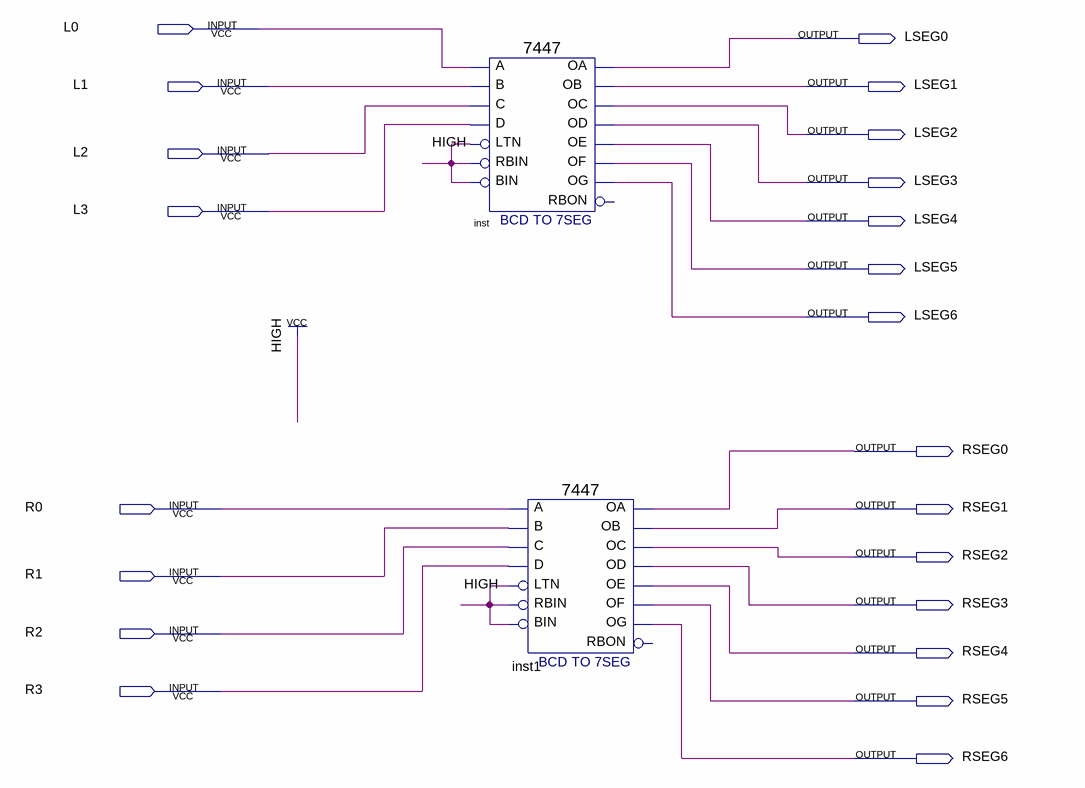
[diagram p0: schematic sheet]
// Quartus schematic 7SegDecoders.bdf as structural Verilog: 2 symbols, 22 pins
module \7SegDecoders  (
  input  L0,
  input  L1,
  input  L2,
  input  L3,
  input  R0,
  input  R1,
  input  R2,
  input  R3,
  output LSEG0,
  output LSEG1,
  output LSEG2,
  output LSEG3,
  output LSEG4,
  output LSEG5,
  output LSEG6,
  output RSEG0,
  output RSEG1,
  output RSEG2,
  output RSEG3,
  output RSEG4,
  output RSEG5,
  output RSEG6
);

  \7447  inst (
    .LTN(1'b1), .B(L1), .C(L2), .D(L3), .RBIN(1'b1), .BIN(1'b1), .A(L0), .OB(LSEG1), .OC(LSEG2), .OE(LSEG4),
    .OD(LSEG3), .OF(LSEG5), .OG(LSEG6), .OA(LSEG0));  // open: RBON
  \7447  inst1 (
    .LTN(1'b1), .B(R1), .C(R2), .D(R3), .RBIN(1'b1), .BIN(1'b1), .A(R0), .OB(RSEG1), .OC(RSEG2), .OE(RSEG4),
    .OD(RSEG3), .OF(RSEG5), .OG(RSEG6), .OA(RSEG0));  // open: RBON
endmodule
